# Altium schematic sheet 1206W4F200LT5E1_1206W4F200LT5E.schdoc
size 127 x 99 mm
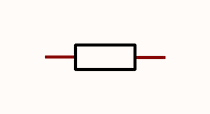
[diagram p0: 1206W4F200LT5E1_1206W4F200LT5E.schdoc]

## Parts
R?  200mΩ  [R1206]  (value not drawn)

## Nets

Not connected (* = marked no-connect by the designer): R? 1 2

## Library data of the parts
R? = 1206W4F200LT5E: Manufacturer: UNI-ROYAL(厚声); Add into BOM: yes; Tolerance: ±1%; Power(Watts): 250mW; Overload Voltage (Max): 200V; Temperature Coefficient: ±800ppm/℃; Symbol: 1206W4F200LT5E; Device: 1206W4F200LT5E; LCSC Part Name: 200mΩ ±1% 250mW 厚膜电阻; Supplier Part: C25335; Manufacturer Part: 1206W4F200LT5E; Supplier Footprint: 1206; JLCPCB Part Class: Extended Part; Datasheet: https://atta.szlcsc.com/upload/public/pdf/source/20200306/C422600_1E6D84923E4A46A82E41ADD87F860B5C.pdf; Supplier: LCSC; Convert to PCB: yes; Type: 厚膜电阻; Value: 200mΩ; Operating Temperature Range: -55℃~+155℃